# EAGLE design rev_2 (EAGLE 5.10)

## Sheet 1 of 2
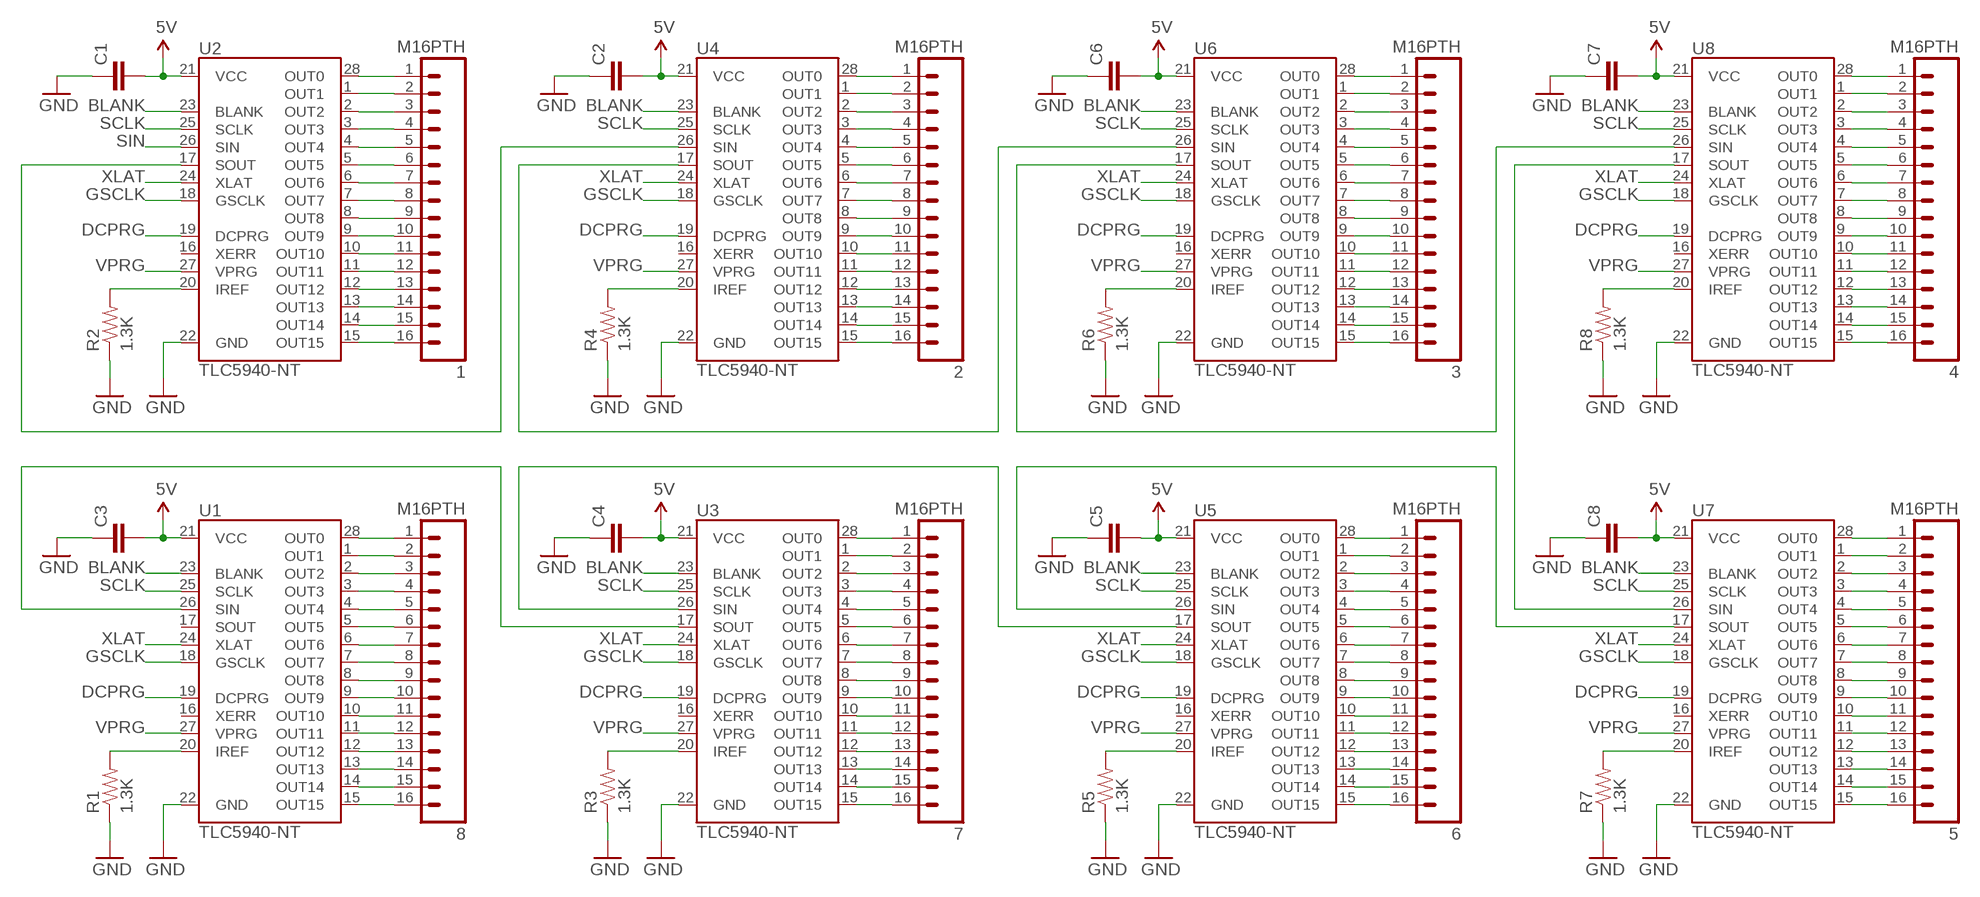
[diagram p0: schematic, sheet 1]

### Parts
1  M16PTH  [1X16]
2  M16PTH  [1X16]
3  M16PTH  [1X16]
4  M16PTH  [1X16]
5  M16PTH  [1X16]
6  M16PTH  [1X16]
7  M16PTH  [1X16]
8  M16PTH  [1X16]
C1  CAPKIT  [CAP-PTH-SMALL-KIT]
C2  CAPKIT  [CAP-PTH-SMALL-KIT]
C3  CAPKIT  [CAP-PTH-SMALL-KIT]
C4  CAPKIT  [CAP-PTH-SMALL-KIT]
C5  CAPKIT  [CAP-PTH-SMALL-KIT]
C6  CAPKIT  [CAP-PTH-SMALL-KIT]
C7  CAPKIT  [CAP-PTH-SMALL-KIT]
C8  CAPKIT  [CAP-PTH-SMALL-KIT]
R1  1.3K  RESISTORPTH-1/6W  [1/6W-RES]
R2  1.3K  RESISTORPTH-1/6W  [1/6W-RES]
R3  1.3K  RESISTORPTH-1/6W  [1/6W-RES]
R4  1.3K  RESISTORPTH-1/6W  [1/6W-RES]
R5  1.3K  RESISTORPTH-1/6W  [1/6W-RES]
R6  1.3K  RESISTORPTH-1/6W  [1/6W-RES]
R7  1.3K  RESISTORPTH-1/6W  [1/6W-RES]
R8  1.3K  RESISTORPTH-1/6W  [1/6W-RES]
U1  TLC5940-NT  [DIL28-3]
U2  TLC5940-NT  [DIL28-3]
U3  TLC5940-NT  [DIL28-3]
U4  TLC5940-NT  [DIL28-3]
U5  TLC5940-NT  [DIL28-3]
U6  TLC5940-NT  [DIL28-3]
U7  TLC5940-NT  [DIL28-3]
U8  TLC5940-NT  [DIL28-3]

### Nets
5V: C1.2 C2.2 C3.2 C4.2 C5.2 C6.2 C7.2 C8.2 U1.21(VCC) U2.21(VCC) U3.21(VCC) U4.21(VCC) U5.21(VCC) U6.21(VCC) U7.21(VCC) U8.21(VCC) ; also sheet 2
BLANK: U1.23(BLANK) U2.23(BLANK) U3.23(BLANK) U4.23(BLANK) U5.23(BLANK) U6.23(BLANK) U7.23(BLANK) U8.23(BLANK)
DCPRG: U1.19(DCPRG) U2.19(DCPRG) U3.19(DCPRG) U4.19(DCPRG) U5.19(DCPRG) U6.19(DCPRG) U7.19(DCPRG) U8.19(DCPRG)
GND: C1.1 C2.1 C3.1 C4.1 C5.1 C6.1 C7.1 C8.1 R1.1 R2.1 R3.1 R4.1 R5.1 R6.1 R7.1 R8.1 U1.22(GND) U2.22(GND) U3.22(GND) U4.22(GND) U5.22(GND) U6.22(GND) U7.22(GND) U8.22(GND) ; also sheet 2
GSCLK: U1.18(GSCLK) U2.18(GSCLK) U3.18(GSCLK) U4.18(GSCLK) U5.18(GSCLK) U6.18(GSCLK) U7.18(GSCLK) U8.18(GSCLK)
N$1: 8.1 U1.28(OUT0)
N$2: 8.2 U1.1(OUT1)
N$3: 8.3 U1.2(OUT2)
N$4: 8.4 U1.3(OUT3)
N$5: 8.5 U1.4(OUT4)
N$6: 8.6 U1.5(OUT5)
N$7: 8.7 U1.6(OUT6)
N$8: 8.8 U1.7(OUT7)
N$9: 8.9 U1.8(OUT8)
N$10: 8.10 U1.9(OUT9)
N$11: 8.11 U1.10(OUT10)
N$12: 8.12 U1.11(OUT11)
N$13: 8.13 U1.12(OUT12)
N$14: 8.14 U1.13(OUT13)
N$15: 8.15 U1.14(OUT14)
N$16: 8.16 U1.15(OUT15)
N$17: R1.2 U1.20(IREF)
N$18: R2.2 U2.20(IREF)
N$19: 1.1 U2.28(OUT0)
N$20: 1.2 U2.1(OUT1)
N$23: 1.3 U2.2(OUT2)
N$24: 1.4 U2.3(OUT3)
N$25: 1.5 U2.4(OUT4)
N$26: 1.6 U2.5(OUT5)
N$27: 1.7 U2.6(OUT6)
N$28: 1.8 U2.7(OUT7)
N$29: 1.9 U2.8(OUT8)
N$30: 1.10 U2.9(OUT9)
N$31: 1.11 U2.10(OUT10)
N$32: 1.12 U2.11(OUT11)
N$33: 1.13 U2.12(OUT12)
N$34: 1.14 U2.13(OUT13)
N$35: 1.15 U2.14(OUT14)
N$36: 1.16 U2.15(OUT15)
N$37: U2.17(SOUT) U4.26(SIN)
N$39: R3.2 U3.20(IREF)
N$40: 7.1 U3.28(OUT0)
N$41: 7.2 U3.1(OUT1)
N$42: 7.3 U3.2(OUT2)
N$43: 7.4 U3.3(OUT3)
N$44: 7.5 U3.4(OUT4)
N$45: 7.6 U3.5(OUT5)
N$46: 7.7 U3.6(OUT6)
N$47: 7.8 U3.7(OUT7)
N$48: 7.9 U3.8(OUT8)
N$49: 7.10 U3.9(OUT9)
N$50: 7.11 U3.10(OUT10)
N$51: 7.12 U3.11(OUT11)
N$52: 7.13 U3.12(OUT12)
N$53: 7.14 U3.13(OUT13)
N$54: 7.15 U3.14(OUT14)
N$55: 7.16 U3.15(OUT15)
N$56: U1.26(SIN) U3.17(SOUT)
N$58: R4.2 U4.20(IREF)
N$59: 2.1 U4.28(OUT0)
N$60: 2.2 U4.1(OUT1)
N$61: 2.3 U4.2(OUT2)
N$62: 2.4 U4.3(OUT3)
N$63: 2.5 U4.4(OUT4)
N$64: 2.6 U4.5(OUT5)
N$65: 2.7 U4.6(OUT6)
N$66: 2.8 U4.7(OUT7)
N$67: 2.9 U4.8(OUT8)
N$68: 2.10 U4.9(OUT9)
N$69: 2.11 U4.10(OUT10)
N$70: 2.12 U4.11(OUT11)
N$71: 2.13 U4.12(OUT12)
N$72: 2.14 U4.13(OUT13)
N$73: 2.15 U4.14(OUT14)
N$74: 2.16 U4.15(OUT15)
N$75: U4.17(SOUT) U6.26(SIN)
N$77: R5.2 U5.20(IREF)
N$78: 6.1 U5.28(OUT0)
N$79: 6.2 U5.1(OUT1)
N$80: 6.3 U5.2(OUT2)
N$81: 6.4 U5.3(OUT3)
N$82: 6.5 U5.4(OUT4)
N$83: 6.6 U5.5(OUT5)
N$84: 6.7 U5.6(OUT6)
N$85: 6.8 U5.7(OUT7)
N$86: 6.9 U5.8(OUT8)
N$87: 6.10 U5.9(OUT9)
N$88: 6.11 U5.10(OUT10)
N$89: 6.12 U5.11(OUT11)
N$90: 6.13 U5.12(OUT12)
N$91: 6.14 U5.13(OUT13)
N$92: 6.15 U5.14(OUT14)
N$93: 6.16 U5.15(OUT15)
N$94: U3.26(SIN) U5.17(SOUT)
N$96: R6.2 U6.20(IREF)
N$97: 3.1 U6.28(OUT0)
N$98: 3.2 U6.1(OUT1)
N$99: 3.3 U6.2(OUT2)
N$100: 3.4 U6.3(OUT3)
N$101: 3.5 U6.4(OUT4)
N$102: 3.6 U6.5(OUT5)
N$103: 3.7 U6.6(OUT6)
N$104: 3.8 U6.7(OUT7)
N$105: 3.9 U6.8(OUT8)
N$106: 3.10 U6.9(OUT9)
N$107: 3.11 U6.10(OUT10)
N$108: 3.12 U6.11(OUT11)
N$109: 3.13 U6.12(OUT12)
N$110: 3.14 U6.13(OUT13)
N$111: 3.15 U6.14(OUT14)
N$112: 3.16 U6.15(OUT15)
N$113: U6.17(SOUT) U8.26(SIN)
N$115: R7.2 U7.20(IREF)
N$116: 5.1 U7.28(OUT0)
N$117: 5.2 U7.1(OUT1)
N$118: 5.3 U7.2(OUT2)
N$119: 5.4 U7.3(OUT3)
N$120: 5.5 U7.4(OUT4)
N$121: 5.6 U7.5(OUT5)
N$122: 5.7 U7.6(OUT6)
N$123: 5.8 U7.7(OUT7)
N$124: 5.9 U7.8(OUT8)
N$125: 5.10 U7.9(OUT9)
N$126: 5.11 U7.10(OUT10)
N$127: 5.12 U7.11(OUT11)
N$128: 5.13 U7.12(OUT12)
N$129: 5.14 U7.13(OUT13)
N$130: 5.15 U7.14(OUT14)
N$131: 5.16 U7.15(OUT15)
N$132: U5.26(SIN) U7.17(SOUT)
N$134: R8.2 U8.20(IREF)
N$135: 4.1 U8.28(OUT0)
N$136: 4.2 U8.1(OUT1)
N$137: 4.3 U8.2(OUT2)
N$138: 4.4 U8.3(OUT3)
N$139: 4.5 U8.4(OUT4)
N$140: 4.6 U8.5(OUT5)
N$141: 4.7 U8.6(OUT6)
N$142: 4.8 U8.7(OUT7)
N$143: 4.9 U8.8(OUT8)
N$144: 4.10 U8.9(OUT9)
N$145: 4.11 U8.10(OUT10)
N$146: 4.12 U8.11(OUT11)
N$147: 4.13 U8.12(OUT12)
N$148: 4.14 U8.13(OUT13)
N$149: 4.15 U8.14(OUT14)
N$150: 4.16 U8.15(OUT15)
N$151: U7.26(SIN) U8.17(SOUT)
SCLK: U1.25(SCLK) U2.25(SCLK) U3.25(SCLK) U4.25(SCLK) U5.25(SCLK) U6.25(SCLK) U7.25(SCLK) U8.25(SCLK)
SIN: U2.26(SIN)
VPRG: U1.27(VPRG) U2.27(VPRG) U3.27(VPRG) U4.27(VPRG) U5.27(VPRG) U6.27(VPRG) U7.27(VPRG) U8.27(VPRG)
XLAT: U1.24(XLAT) U2.24(XLAT) U3.24(XLAT) U4.24(XLAT) U5.24(XLAT) U6.24(XLAT) U7.24(XLAT) U8.24(XLAT)
Unconnected: U1.16(XERR) U1.17(SOUT) U2.16(XERR) U3.16(XERR) U4.16(XERR) U5.16(XERR) U6.16(XERR) U7.16(XERR) U8.16(XERR)

## Sheet 2 of 2
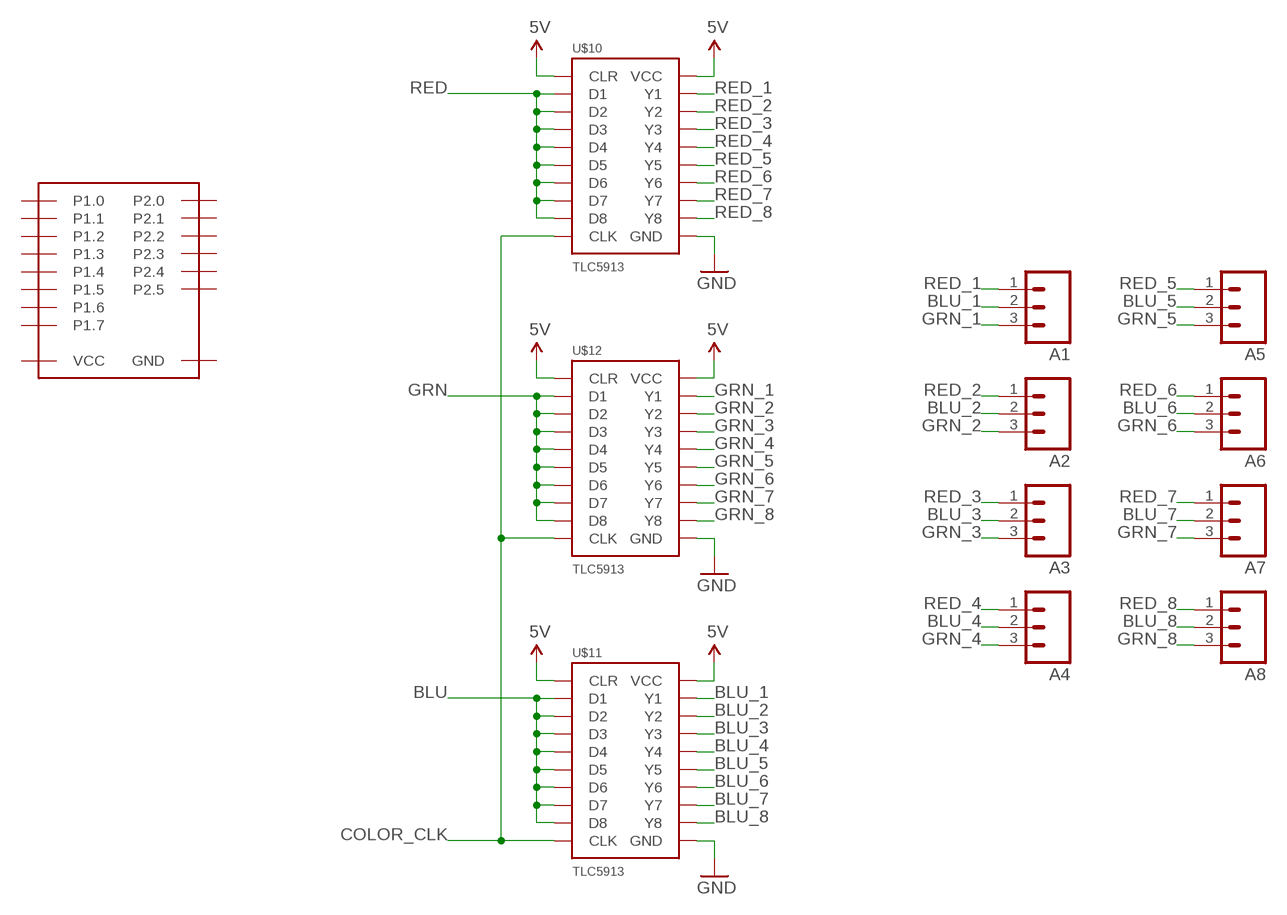
[diagram p1: schematic, sheet 2]

### Parts
A1  M03PTH  [1X03]
A2  M03PTH  [1X03]
A3  M03PTH  [1X03]
A4  M03PTH  [1X03]
A5  M03PTH  [1X03]
A6  M03PTH  [1X03]
A7  M03PTH  [1X03]
A8  M03PTH  [1X03]
U$9  TI_LAUNCHPAD  [TI_LAUNCHPAD]
U$10  TLC5913  [TLC59213]
U$11  TLC5913  [TLC59213]
U$12  TLC5913  [TLC59213]

### Nets
5V: U$10.CLR U$10.VCC U$11.CLR U$11.VCC U$12.CLR U$12.VCC ; also sheet 1
BLU: U$11.D1 U$11.D2 U$11.D3 U$11.D4 U$11.D5 U$11.D6 U$11.D7 U$11.D8
BLU_1: A1.2 U$11.Y1
BLU_2: A2.2 U$11.Y2
BLU_3: A3.2 U$11.Y3
BLU_4: A4.2 U$11.Y4
BLU_5: A5.2 U$11.Y5
BLU_6: A6.2 U$11.Y6
BLU_7: A7.2 U$11.Y7
BLU_8: A8.2 U$11.Y8
COLOR_CLK: U$10.CLK U$11.CLK U$12.CLK
GND: U$10.GND U$11.GND U$12.GND ; also sheet 1
GRN: U$12.D1 U$12.D2 U$12.D3 U$12.D4 U$12.D5 U$12.D6 U$12.D7 U$12.D8
GRN_1: A1.3 U$12.Y1
GRN_2: A2.3 U$12.Y2
GRN_3: A3.3 U$12.Y3
GRN_4: A4.3 U$12.Y4
GRN_5: A5.3 U$12.Y5
GRN_6: A6.3 U$12.Y6
GRN_7: A7.3 U$12.Y7
GRN_8: A8.3 U$12.Y8
RED: U$10.D1 U$10.D2 U$10.D3 U$10.D4 U$10.D5 U$10.D6 U$10.D7 U$10.D8
RED_1: A1.1 U$10.Y1
RED_2: A2.1 U$10.Y2
RED_3: A3.1 U$10.Y3
RED_4: A4.1 U$10.Y4
RED_5: A5.1 U$10.Y5
RED_6: A6.1 U$10.Y6
RED_7: A7.1 U$10.Y7
RED_8: A8.1 U$10.Y8
Unconnected: U$9.GND U$9.P1.0 U$9.P1.1 U$9.P1.2 U$9.P1.3 U$9.P1.4 U$9.P1.5 U$9.P1.6 U$9.P1.7 U$9.P2.0 U$9.P2.1 U$9.P2.2 U$9.P2.3 U$9.P2.4 U$9.P2.5 U$9.VCC

## Library data of the parts
1-8 = SparkFun:M16
A1-A8 = SparkFun:M03: Header 3 Standard 3-pin 0.1" header. Use with straight break away headers (SKU : PRT-00116), right angle break away headers (PRT-00553), swiss pins (PRT-00743), machine pins (PRT-00117), and female headers (PRT-00115). Molex polarized connector foot print use with SKU : PRT-08232 with associated crimp pins and housings.
C1-C8 = SparkFun:CAP: Capacitor Standard 0603 ceramic capacitor, and 0.1" leaded capacitor.
R1-R8 = SparkFun:RESISTOR: Resistor Basic schematic elements and footprints for 0603, 1206, and PTH resistors.
U1-U8 = SparkFun:TLC5940: TI TLC5940 16-channel LED Driver with Dot Correction and Grayscale PWM Control The TLC5940 is a 16-channel, constant-current sink LED driver. Each channel has an individually adjustable 4096-step grayscale PWM brightness control and a 64-step, constant-current sink (dot correction). The dot correction adjusts the brightness variations between LED channels and other LED drivers. The dot correction data is stored in an integrated EEPROM. Both grayscale control and dot correction are accessible via a serial interface. A single external resistor sets the maximum current value of all 16 channels. Packages: 28-pin HTSSOP 32-pin 5x5mm QFN 28-pin DIP
U$9 = launchpad_comp:TI_LAUNCHPAD
U$10-U$12 = launchpad_comp:TLC5913: TLC59213A http://focus.ti.com/docs/prod/folders/print/tlc59213a.html; VALUE: TLC59213A

## Board
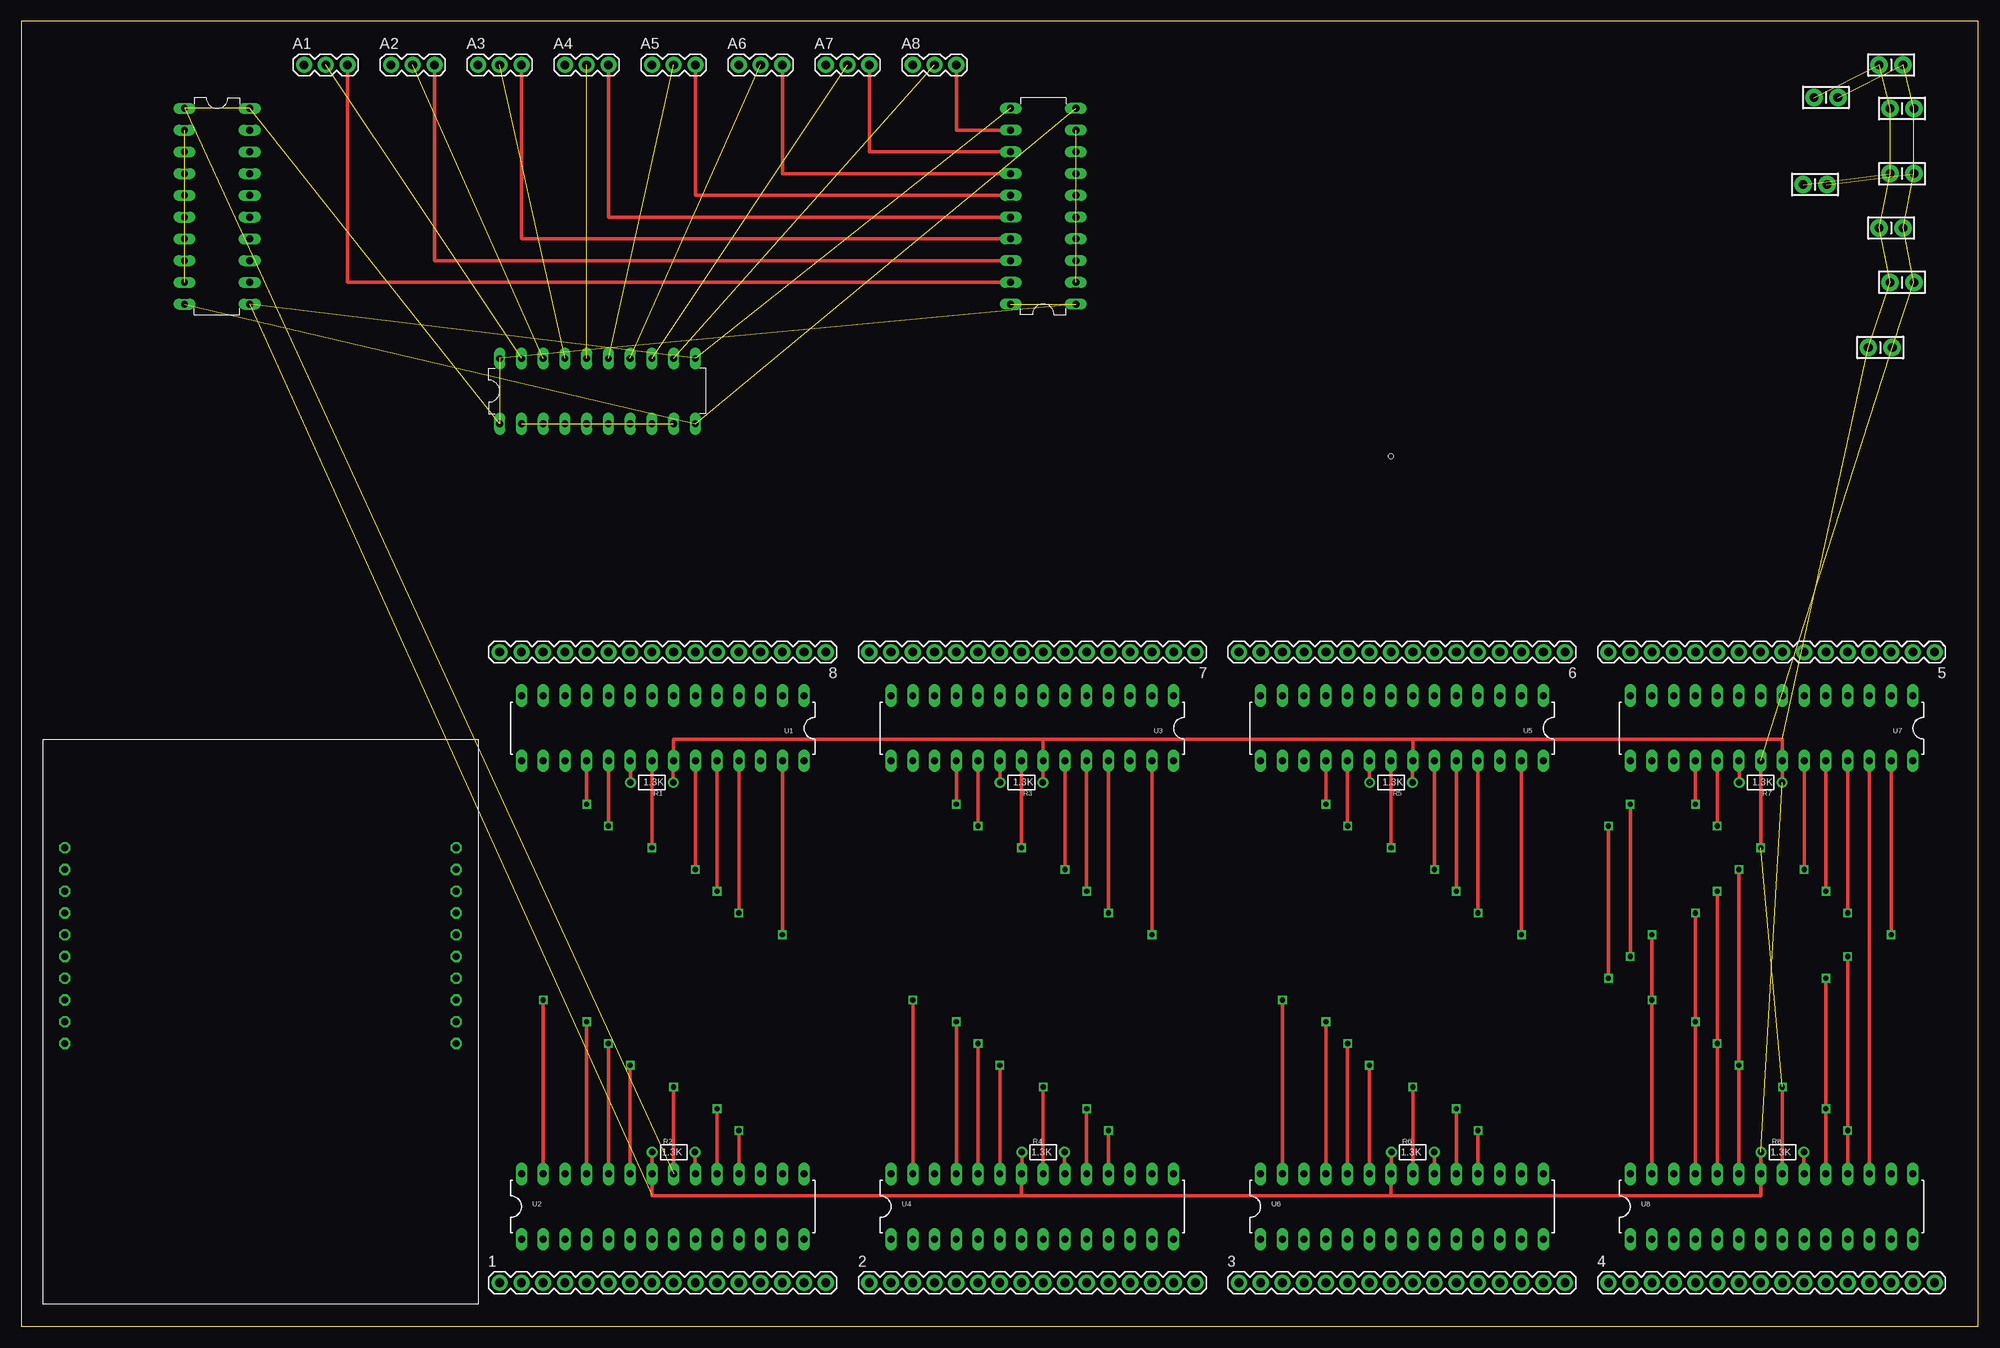
[diagram p2: board, top side]
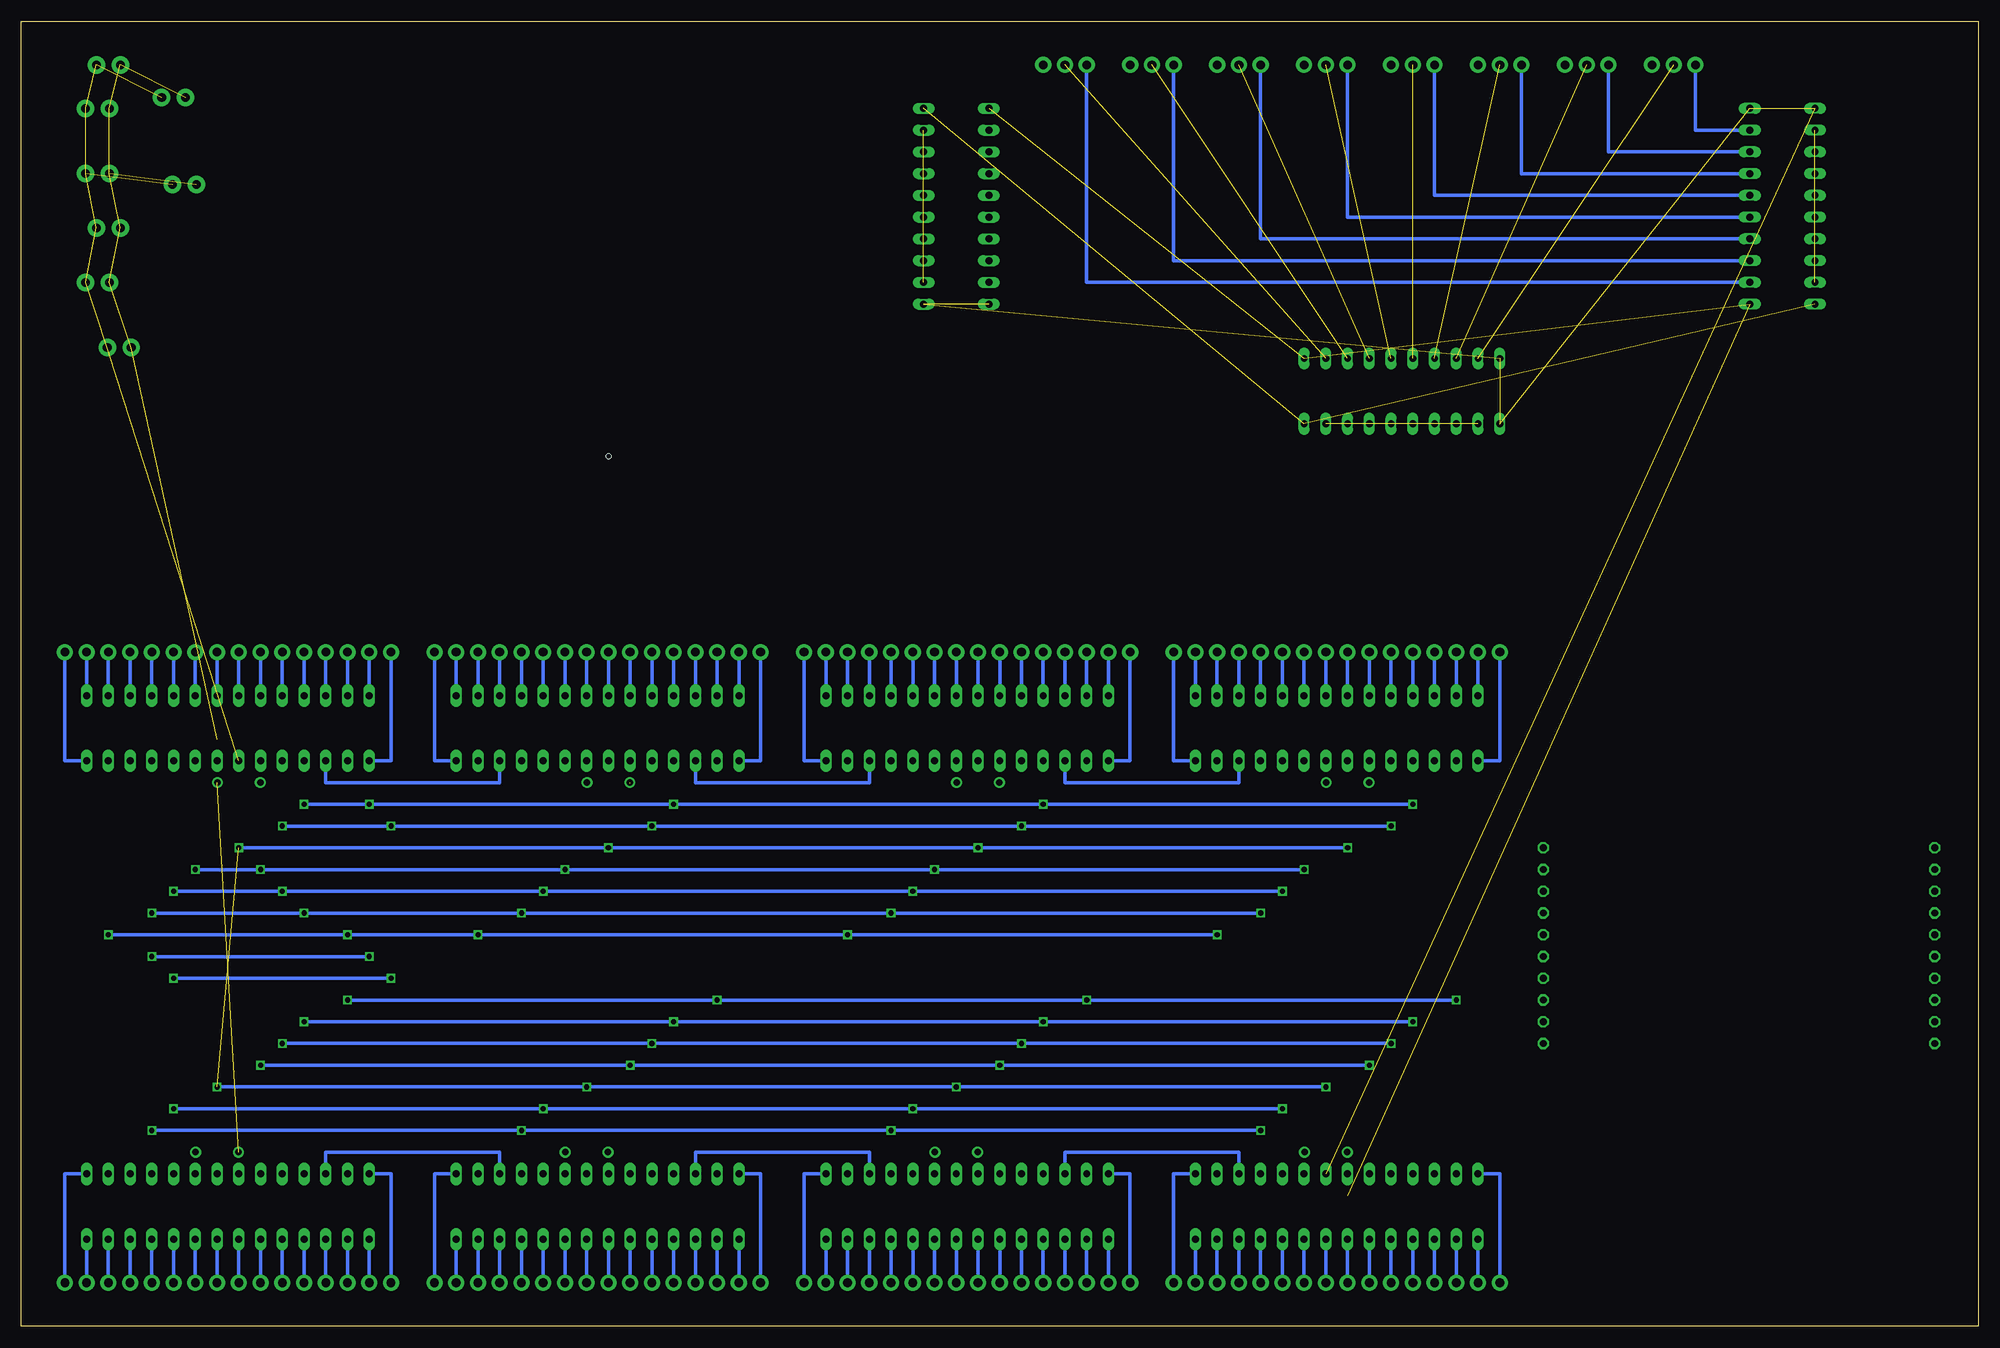
[diagram p3: board, bottom side, seen from below]

Size 228.6 x 152.4 mm. Coordinates in mm from the lower left corner, seen from the top.
Outline: 0,0 228.6,0 228.6,152.4 0,152.4 0,0
Copper layers (1*16): Top 0.035mm / dielectric 1.5mm / Bottom 0.035mm
Design rules "default": minimum track width 10mil, minimum drill 24mil, track to track 8mil, track to pad 8mil, pad to pad 8mil, via to via 8mil, smd to smd 8mil, copper to edge 40mil, drill to drill 8mil, minimum pad ring 10mil, minimum via ring 8mil, stop-mask expansion 4mil, vias tented up to drill 0mil, thermal gap 10mil
Holes 0.6 mm at 160.02,101.6

### Footprints (pad centres in the part's own frame; a part is rotated, then mirrored left to right if it is on the bottom)
1X16 = drill 1.016 pad 1.88 round: 1 0,0; 2 2.54,0; 3 5.08,0; 4 7.62,0; 5 10.16,0; 6 12.7,0; 7 15.24,0; 8 17.78,0; 9 20.32,0; 10 22.86,0; 11 25.4,0; 12 27.94,0; 13 30.48,0; 14 33.02,0; 15 35.56,0; 16 38.1,0
1X03 = drill 1.016 pad 1.88 round: 1 0,0; 2 2.54,0; 3 5.08,0
CAP-PTH-SMALL-KIT = drill 1.016 pad 2.032 round: 1 -1.397,0; 2 1.397,0
1/6W-RES = drill 0.762 round: 1 -2.5,0; 2 2.5,0
DIL28-3 = drill 0.813 long: 1 -16.51,-3.81; 2 -13.97,-3.81; 3 -11.43,-3.81; 4 -8.89,-3.81; 5 -6.35,-3.81; 6 -3.81,-3.81; 7 -1.27,-3.81; 8 1.27,-3.81; 9 3.81,-3.81; 10 6.35,-3.81; 11 8.89,-3.81; 12 11.43,-3.81; 13 13.97,-3.81; 14 16.51,-3.81; 15 16.51,3.81; 16 13.97,3.81; 17 11.43,3.81; 18 8.89,3.81; 19 6.35,3.81; 20 3.81,3.81; 21 1.27,3.81; 22 -1.27,3.81; 23 -3.81,3.81; 24 -6.35,3.81; 25 -8.89,3.81; 26 -11.43,3.81; 27 -13.97,3.81; 28 -16.51,3.81
TI_LAUNCHPAD = drill 0.8 octagon: GND 48.26,35.56; P1.0 2.54,33.02; P1.1 2.54,30.48; P1.2 2.54,27.94; P1.3 2.54,25.4; P1.4 2.54,22.86; P1.5 2.54,20.32; P1.6 48.26,20.32; P1.7 48.26,22.86; P2.0 2.54,17.78; P2.1 2.54,15.24; P2.2 2.54,12.7; P2.3 48.26,12.7; P2.4 48.26,15.24; P2.5 48.26,17.78; RST 48.26,25.4; TEST 48.26,27.94; VCC 2.54,35.56; XIN 48.26,33.02; XOUT 48.26,30.48
TLC59213 = drill 0.8 long: CLK -10.16,3.81; CLR 12.7,3.81; D1 10.16,3.81; D2 7.62,3.81; D3 5.08,3.81; D4 2.54,3.81; D5 0,3.81; D6 -2.54,3.81; D7 -5.08,3.81; D8 -7.62,3.81; GND -10.16,-3.81; VCC 12.7,-3.81; Y1 10.16,-3.81; Y2 7.62,-3.81; Y3 5.08,-3.81; Y4 2.54,-3.81; Y5 0,-3.81; Y6 -2.54,-3.81; Y7 -5.08,-3.81; Y8 -7.62,-3.81

### Placement (x,y rotation side)
1  55.88,5.08 0 top
2  99.06,5.08 0 top
3  142.24,5.08 0 top
4  185.42,5.08 0 top
5  223.52,78.74 180 top
6  180.34,78.74 180 top
7  137.16,78.74 180 top
8  93.98,78.74 180 top
A1  33.02,147.32 0 top
A2  43.18,147.32 0 top
A3  53.34,147.32 0 top
A4  63.5,147.32 0 top
A5  73.66,147.32 0 top
A6  83.82,147.32 0 top
A7  93.98,147.32 0 top
A8  104.14,147.32 0 top
C1  219.71,121.92 0 top
C2  217.17,114.3 0 top
C3  210.82,143.51 0 top
C4  209.55,133.35 0 top
C5  219.71,134.62 0 top
C6  218.44,128.27 0 top
C7  218.44,147.32 0 top
C8  219.71,142.24 0 top
R1  73.66,63.5 180 top
R2  76.2,20.32 0 top
R3  116.84,63.5 180 top
R4  119.38,20.32 0 top
R5  160.02,63.5 180 top
R6  162.56,20.32 0 top
R7  203.2,63.5 180 top
R8  205.74,20.32 0 top
U1  74.93,69.85 180 top
U2  74.93,13.97 0 top
U3  118.11,69.85 180 top
U4  118.11,13.97 0 top
U5  161.29,69.85 180 top
U6  161.29,13.97 0 top
U7  204.47,69.85 180 top
U8  204.47,13.97 0 top
U$9  53.34,68.58 180 top
U$10  22.86,129.54 90 top
U$11  68.58,109.22 180 top
U$12  119.38,132.08 270 top

### Tracks (layer width: path | path; a pad name or v marks a point on that pad's centre or on a via)
5V  (via drill 0.6)  (15 unrouted)
  Top 0.406: U2.21 v76.2,27.94 | v119.38,27.94 U4.21 | v162.56,27.94 U6.21 | v205.74,27.94 U8.21 | 203.2,60.96 U7.21 v203.2,55.88 | v73.66,55.88 U1.21 | v116.84,55.88 U3.21 | v160.02,55.88 U5.21
  Bottom 0.406: v76.2,27.94 v119.38,27.94 v162.56,27.94 v205.74,27.94 | v73.66,55.88 v116.84,55.88 v160.02,55.88 v203.2,55.88
BLANK  (via drill 0.6)
  Top 0.406: v71.12,30.48 U2.23 | v114.3,30.48 U4.23 | v157.48,30.48 U6.23 | U8.23 v200.66,30.48 v200.66,53.34 | v78.74,53.34 U1.23 | v208.28,53.34 U7.23 | v121.92,53.34 U3.23 | v165.1,53.34 U5.23
  Bottom 0.406: v71.12,30.48 v114.3,30.48 v157.48,30.48 v200.66,30.48 | v78.74,53.34 v121.92,53.34 v165.1,53.34 v200.66,53.34 v208.28,53.34
BLU  (7 unrouted)
BLU_1  (1 unrouted)
BLU_2  (1 unrouted)
BLU_3  (1 unrouted)
BLU_4  (1 unrouted)
BLU_5  (1 unrouted)
BLU_6  (1 unrouted)
BLU_7  (1 unrouted)
BLU_8  (1 unrouted)
COLOR_CLK  (2 unrouted)
DCPRG  (via drill 0.6)
  Top 0.406: v81.28,25.4 U2.19 | v124.46,25.4 U4.19 | v167.64,25.4 U6.19 | U8.19 v210.82,25.4 v210.82,40.64 | v198.12,58.42 U7.19 | v154.94,58.42 U5.19 | v111.76,58.42 U3.19 | v68.58,58.42 U1.19 | v185.42,58.42 v185.42,40.64
  Bottom 0.406: v81.28,25.4 v124.46,25.4 v167.64,25.4 v210.82,25.4 | v198.12,58.42 v185.42,58.42 v154.94,58.42 v111.76,58.42 v68.58,58.42 | v185.42,40.64 v210.82,40.64
GND  (12 unrouted)
  Top 0.406: R2.1 73.7,17.78 U2.22 73.66,15.24 116.84,15.24 | R4.1 116.88,17.78 U4.22 116.84,15.24 | R6.1 160.06,17.78 U6.22 160.02,15.24 | R8.1 203.24,17.78 U8.22 203.2,15.24 160.02,15.24 | R7.1 205.7,66.04 U7.22 205.74,68.58 162.56,68.58 | R5.1 162.52,66.04 U5.22 162.56,68.58 | R3.1 119.34,66.04 U3.22 119.38,68.58 | R1.1 76.16,66.04 U1.22 76.2,68.58 119.38,68.58 | 162.56,68.58 119.38,68.58 | 116.84,15.24 160.02,15.24
GRN  (7 unrouted)
GRN_1
  Top 0.406: U$12.Y1 38.1,121.92 A1.3
GRN_2
  Top 0.406: U$12.Y2 48.26,124.46 A2.3
GRN_3
  Top 0.406: U$12.Y3 58.42,127 A3.3
GRN_4
  Top 0.406: U$12.Y4 68.58,129.54 A4.3
GRN_5
  Top 0.406: U$12.Y5 78.74,132.08 A5.3
GRN_6
  Top 0.406: U$12.Y6 88.9,134.62 A6.3
GRN_7
  Top 0.406: U$12.Y7 99.06,137.16 A7.3
GRN_8
  Top 0.406: U$12.Y8 109.22,139.7 A8.3
GSCLK  (via drill 0.6)
  Top 0.406: v83.82,22.86 U2.18 | v127,22.86 U4.18 | v170.18,22.86 U6.18 | U8.18 v213.36,22.86 v213.36,43.18 | v195.58,60.96 U7.18 | v152.4,60.96 U5.18 | v109.22,60.96 U3.18 | v66.04,60.96 U1.18 | v187.96,43.18 v187.96,60.96
  Bottom 0.406: v83.82,22.86 v127,22.86 v170.18,22.86 v213.36,22.86 | v66.04,60.96 v109.22,60.96 v152.4,60.96 v187.96,60.96 v195.58,60.96 | v213.36,43.18 v187.96,43.18
N$1
  Bottom 0.406: U1.28 93.98,66.04 8.1
N$2
  Bottom 0.406: U1.1 8.2
N$3
  Bottom 0.406: U1.2 8.3
N$4
  Bottom 0.406: U1.3 8.4
N$5
  Bottom 0.406: U1.4 8.5
N$6
  Bottom 0.406: U1.5 8.6
N$7
  Bottom 0.406: U1.6 8.7
N$8
  Bottom 0.406: U1.7 8.8
N$9
  Bottom 0.406: U1.8 8.9
N$10
  Bottom 0.406: U1.9 8.10
N$11
  Bottom 0.406: U1.10 8.11
N$12
  Bottom 0.406: U1.11 8.12
N$13
  Bottom 0.406: U1.12 8.13
N$14
  Bottom 0.406: U1.13 8.14
N$15
  Bottom 0.406: U1.14 8.15
N$16
  Bottom 0.406: U1.15 55.88,66.04 8.16
N$17
  Top 0.406: U1.20 71.16,66.04 R1.2
N$18
  Top 0.406: R2.2 U2.20
N$19
  Bottom 0.406: U2.28 55.88,17.78 1.1
N$20
  Bottom 0.406: 1.2 U2.1
N$23
  Bottom 0.406: 1.3 U2.2
N$24
  Bottom 0.406: 1.4 U2.3
N$25
  Bottom 0.406: 1.5 U2.4
N$26
  Bottom 0.406: 1.6 U2.5
N$27
  Bottom 0.406: 1.7 U2.6
N$28
  Bottom 0.406: 1.8 U2.7
N$29
  Bottom 0.406: 1.9 U2.8
N$30
  Bottom 0.406: 1.10 U2.9
N$31
  Bottom 0.406: 1.11 U2.10
N$32
  Bottom 0.406: 1.12 U2.11
N$33
  Bottom 0.406: 1.13 U2.12
N$34
  Bottom 0.406: 1.14 U2.13
N$35
  Bottom 0.406: 1.15 U2.14
N$36
  Bottom 0.406: U2.15 93.98,17.78 1.16
N$37
  Bottom 0.406: U2.17 86.36,20.32 106.68,20.32 U4.26
N$39
  Top 0.406: U3.20 114.34,66.04 R3.2
N$40
  Bottom 0.406: U3.28 137.16,66.04 7.1
N$41
  Bottom 0.406: U3.1 7.2
N$42
  Bottom 0.406: U3.2 7.3
N$43
  Bottom 0.406: U3.3 7.4
N$44
  Bottom 0.406: U3.4 7.5
N$45
  Bottom 0.406: U3.5 7.6
N$46
  Bottom 0.406: U3.6 7.7
N$47
  Bottom 0.406: U3.7 7.8
N$48
  Bottom 0.406: U3.8 7.9
N$49
  Bottom 0.406: U3.9 7.10
N$50
  Bottom 0.406: U3.10 7.11
N$51
  Bottom 0.406: U3.11 7.12
N$52
  Bottom 0.406: U3.12 7.13
N$53
  Bottom 0.406: U3.13 7.14
N$54
  Bottom 0.406: U3.14 7.15
N$55
  Bottom 0.406: U3.15 99.06,66.04 7.16
N$56
  Bottom 0.406: U3.17 106.68,63.5 86.36,63.5 U1.26
N$58
  Top 0.406: U4.20 121.88,17.78 R4.2
N$59
  Bottom 0.406: U4.28 99.06,17.78 2.1
N$60
  Bottom 0.406: 2.2 U4.1
N$61
  Bottom 0.406: 2.3 U4.2
N$62
  Bottom 0.406: 2.4 U4.3
N$63
  Bottom 0.406: 2.5 U4.4
N$64
  Bottom 0.406: 2.6 U4.5
N$65
  Bottom 0.406: 2.7 U4.6
N$66
  Bottom 0.406: 2.8 U4.7
N$67
  Bottom 0.406: 2.9 U4.8
N$68
  Bottom 0.406: 2.10 U4.9
N$69
  Bottom 0.406: 2.11 U4.10
N$70
  Bottom 0.406: 2.12 U4.11
N$71
  Bottom 0.406: 2.13 U4.12
N$72
  Bottom 0.406: 2.14 U4.13
N$73
  Bottom 0.406: 2.15 U4.14
N$74
  Bottom 0.406: U4.15 137.16,17.78 2.16
N$75
  Bottom 0.406: U4.17 129.54,20.32 149.86,20.32 U6.26
N$77  (1 unrouted)
  Top 0.406: 157.48,63.5 U5.20
N$78
  Bottom 0.406: U5.28 180.34,66.04 6.1
N$79
  Bottom 0.406: 6.2 U5.1
N$80
  Bottom 0.406: 6.3 U5.2
N$81
  Bottom 0.406: U5.3 6.4
N$82
  Bottom 0.406: U5.4 6.5
N$83
  Bottom 0.406: U5.5 6.6
N$84
  Bottom 0.406: U5.6 6.7
N$85
  Bottom 0.406: U5.7 6.8
N$86
  Bottom 0.406: U5.8 6.9
N$87
  Bottom 0.406: U5.9 6.10
N$88
  Bottom 0.406: U5.10 6.11
N$89
  Bottom 0.406: U5.11 6.12
N$90
  Bottom 0.406: U5.12 6.13
N$91
  Bottom 0.406: U5.13 6.14
N$92
  Bottom 0.406: U5.14 6.15
N$93
  Bottom 0.406: U5.15 142.24,66.04 6.16
N$94
  Bottom 0.406: U5.17 149.86,63.5 129.54,63.5 U3.26
N$96
  Top 0.406: U6.20 165.06,17.78 R6.2
N$97
  Bottom 0.406: U6.28 142.24,17.78 3.1
N$98
  Bottom 0.406: 3.2 U6.1
N$99
  Bottom 0.406: 3.3 U6.2
N$100
  Bottom 0.406: 3.4 U6.3
N$101
  Bottom 0.406: 3.5 U6.4
N$102
  Bottom 0.406: 3.6 U6.5
N$103
  Bottom 0.406: 3.7 U6.6
N$104
  Bottom 0.406: 3.8 U6.7
N$105
  Bottom 0.406: 3.9 U6.8
N$106
  Bottom 0.406: 3.10 U6.9
N$107
  Bottom 0.406: 3.11 U6.10
N$108
  Bottom 0.406: 3.12 U6.11
N$109
  Bottom 0.406: 3.13 U6.12
N$110
  Bottom 0.406: 3.14 U6.13
N$111
  Bottom 0.406: 3.15 U6.14
N$112
  Bottom 0.406: U6.15 180.34,17.78 3.16
N$113
  Bottom 0.406: U6.17 172.72,20.32 193.04,20.32 U8.26
N$115
  Top 0.406: U7.20 200.7,66.04 R7.2
N$116
  Bottom 0.406: U7.28 223.52,66.04 5.1
N$117
  Bottom 0.406: U7.1 5.2
N$118
  Bottom 0.406: U7.2 5.3
N$119
  Bottom 0.406: U7.3 5.4
N$120
  Bottom 0.406: U7.4 5.5
N$121
  Bottom 0.406: U7.5 5.6
N$122
  Bottom 0.406: U7.6 5.7
N$123
  Bottom 0.406: U7.7 5.8
N$124
  Bottom 0.406: U7.8 5.9
N$125
  Bottom 0.406: U7.9 5.10
N$126
  Bottom 0.406: U7.10 5.11
N$127
  Bottom 0.406: U7.11 5.12
N$128
  Bottom 0.406: U7.12 5.13
N$129
  Bottom 0.406: U7.13 5.14
N$130
  Bottom 0.406: U7.14 5.15
N$131
  Bottom 0.406: U7.15 185.42,66.04 5.16
N$132
  Bottom 0.406: U7.17 193.04,63.5 172.72,63.5 U5.26
N$134
  Top 0.406: U8.20 208.24,17.78 R8.2
N$135
  Bottom 0.406: U8.28 185.42,17.78 4.1
N$136
  Bottom 0.406: 4.2 U8.1
N$137
  Bottom 0.406: 4.3 U8.2
N$138
  Bottom 0.406: 4.4 U8.3
N$139
  Bottom 0.406: 4.5 U8.4
N$140
  Bottom 0.406: 4.6 U8.5
N$141
  Bottom 0.406: 4.7 U8.6
N$142
  Bottom 0.406: 4.8 U8.7
N$143
  Bottom 0.406: 4.9 U8.8
N$144
  Bottom 0.406: 4.10 U8.9
N$145
  Bottom 0.406: 4.11 U8.10
N$146
  Bottom 0.406: 4.12 U8.11
N$147
  Bottom 0.406: 4.13 U8.12
N$148
  Bottom 0.406: 4.14 U8.13
N$149
  Bottom 0.406: 4.15 U8.14
N$150
  Bottom 0.406: U8.15 223.52,17.78 4.16
N$151
  Top 0.406: U7.26 U8.17
RED  (7 unrouted)
RED_1
  Bottom 0.406: U$10.Y1 33.02,139.7 A1.1
RED_2
  Bottom 0.406: U$10.Y2 43.18,137.16 A2.1
RED_3
  Bottom 0.406: U$10.Y3 53.34,134.62 A3.1
RED_4
  Bottom 0.406: U$10.Y4 63.5,132.08 A4.1
RED_5
  Bottom 0.406: U$10.Y5 73.66,129.54 A5.1
RED_6
  Bottom 0.406: U$10.Y6 83.82,127 A6.1
RED_7
  Bottom 0.406: U$10.Y7 93.98,124.46 A7.1
RED_8
  Bottom 0.406: U$10.Y8 104.14,121.92 A8.1
SCLK  (via drill 0.6)
  Top 0.406: v66.04,35.56 U2.25 | v109.22,35.56 U4.25 | v152.4,35.56 U6.25 | U8.25 v195.58,35.56 v195.58,48.26 | v213.36,48.26 U7.25 | v170.18,48.26 U5.25 | v127,48.26 U3.25 | v83.82,48.26 U1.25
  Bottom 0.406: v66.04,35.56 v109.22,35.56 v152.4,35.56 v195.58,35.56 | v83.82,48.26 v127,48.26 v170.18,48.26 v195.58,48.26 v213.36,48.26
VPRG  (via drill 0.6)
  Top 0.406: v60.96,38.1 U2.27 | v104.14,38.1 U4.27 | v147.32,38.1 U6.27 | U8.27 v190.5,38.1 v190.5,45.72 | v218.44,45.72 U7.27 | v175.26,45.72 U5.27 | v132.08,45.72 U3.27 | v88.9,45.72 U1.27
  Bottom 0.406: v60.96,38.1 v104.14,38.1 v147.32,38.1 v190.5,38.1 | v218.44,45.72 v190.5,45.72 v175.26,45.72 v132.08,45.72 v88.9,45.72
XLAT  (via drill 0.6)
  Top 0.406: v68.58,33.02 U2.24 | v111.76,33.02 U4.24 | v154.94,33.02 U6.24 | U8.24 v198.12,33.02 v198.12,50.8 | v210.82,50.8 U7.24 | v167.64,50.8 U5.24 | v124.46,50.8 U3.24 | v81.28,50.8 U1.24
  Bottom 0.406: v68.58,33.02 v111.76,33.02 v154.94,33.02 v198.12,33.02 | v210.82,50.8 v198.12,50.8 v167.64,50.8 v124.46,50.8 v81.28,50.8